# EAGLE design testboard (EAGLE 8.3.1)
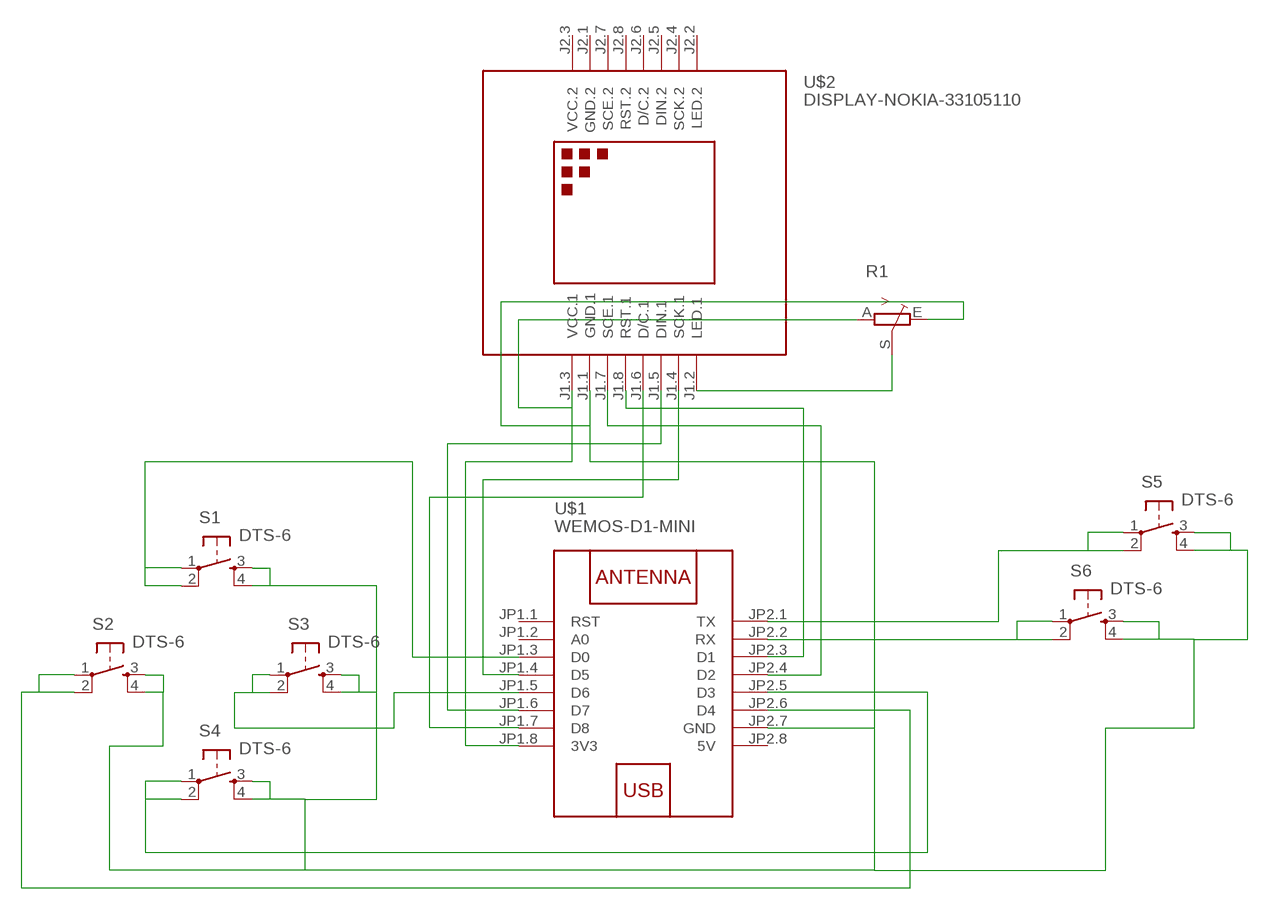
[diagram p0: schematic, sheet 1]

## Parts
R1  TRIM_EU-B25U  [B25U]
S1  DTS-6  [DTS-6]
S2  DTS-6  [DTS-6]
S3  DTS-6  [DTS-6]
S4  DTS-6  [DTS-6]
S5  DTS-6  [DTS-6]
S6  DTS-6  [DTS-6]
U$1  WEMOS-D1-MINI  [WEMOS-D1-MINI]
U$2  DISPLAY-NOKIA-33105110  [DISPLAY-NOKIA-3310]

## Nets
N$1: R1.A U$1.JP1.8(3V3) U$2.J1.3(VCC.1)
N$2: R1.E S1.3 S1.4 S2.3 S2.4 S3.3 S3.4 S4.3 S4.4 S5.3 S5.4 S6.3 S6.4 U$1.JP2.7(GND) U$2.J1.1(GND.1)
N$3: S1.1 S1.2 U$1.JP1.3(D0)
N$4: U$1.JP1.4(D5) U$2.J1.4(SCK.1)
N$5: U$1.JP2.3(D1) U$2.J1.8(RST.1)
N$6: U$1.JP1.6(D7) U$2.J1.5(DIN.1)
N$7: U$1.JP2.4(D2) U$2.J1.7(SCE.1)
N$8: R1.S U$2.J1.2(LED.1)
N$9: S3.1 S3.2 U$1.JP1.5(D6)
N$10: S2.1 S2.2 U$1.JP2.6(D4)
N$11: S4.1 S4.2 U$1.JP2.5(D3)
N$12: S6.1 S6.2 U$1.JP2.2(RX)
N$13: S5.1 S5.2 U$1.JP2.1(TX)
N$14: U$1.JP1.7(D8) U$2.J1.6(D/C.1)
Unconnected: U$1.JP1.1(RST) U$1.JP1.2(A0) U$2.J2.2(LED.2) U$2.J2.4(SCK.2) U$2.J2.5(DIN.2) U$2.J2.6(D/C.2) U$2.J2.7(SCE.2) U$2.J2.8(RST.2)

## Power pins joined to a net without a drawn wire
5V: U$1.JP2.8(5V)
GND.2: U$2.J2.1(GND.2)
VCC.2: U$2.J2.3(VCC.2)

## Library data of the parts
R1 = pot:TRIM_EU-: POTENTIOMETER
S1-S6 = switch-tact:DTS-6
U$1 = diy-modules:WEMOS-D1-MINI: WEMOS D1 mini: Mini Wi-Fi Board based on ESP-8266 device More details can be found here: https://www.wemos.cc/product/d1-mini.html Click here to find device on ebay.com <http://www.ebay.com/sch/wemos+d1+mini+nodemcu>
U$2 = diy-modules:DISPLAY-NOKIA-3310: 84x48 Dot Matrix LCD Module based on Nokia 3310 display More details available here: https://arduinoandsoftware.wordpress.com/2012/12/30/nokia-33105110-3-3v-display-with-5v-arduino/

## Board
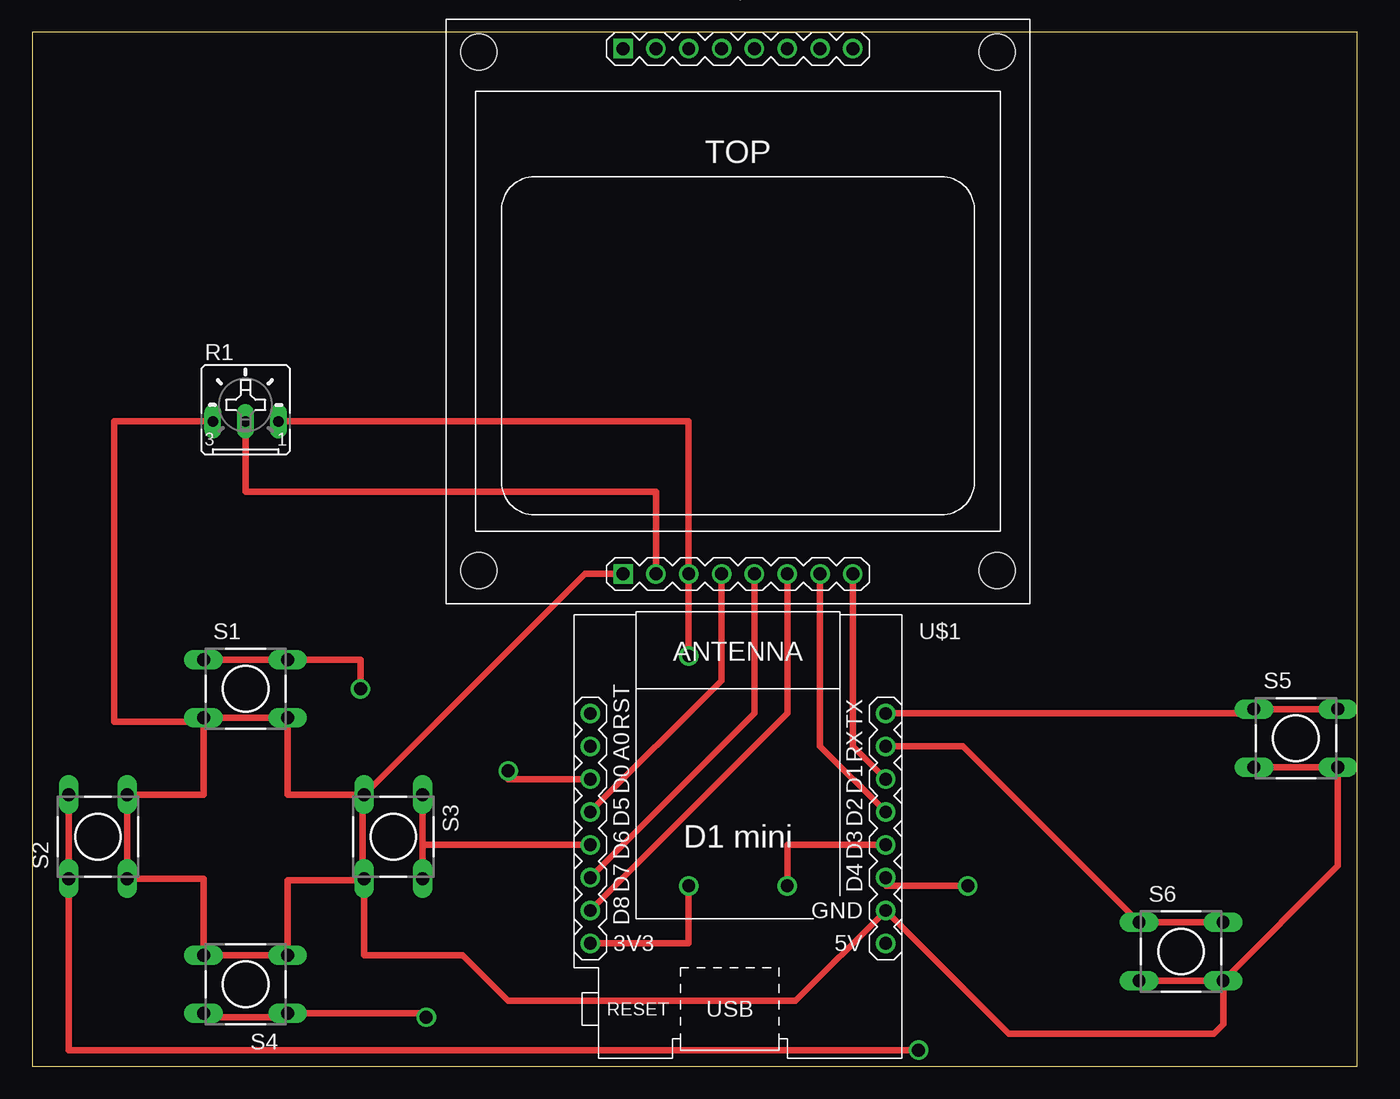
[diagram p1: board, top side]
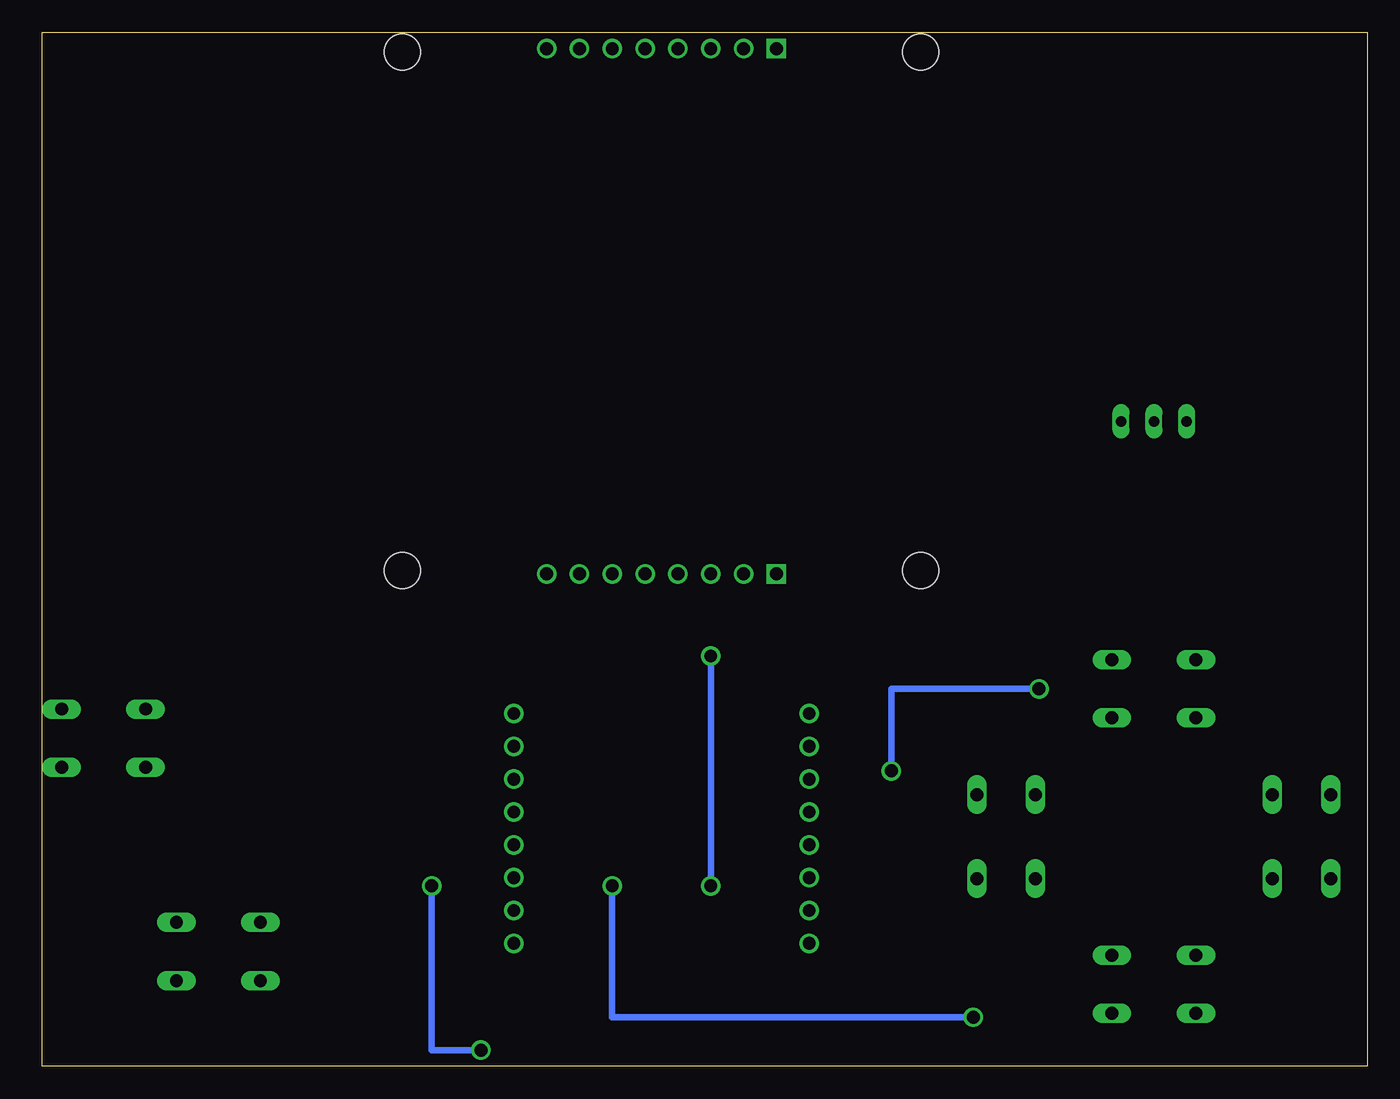
[diagram p2: board, bottom side, seen from below]

Size 102.54 x 80 mm. Coordinates in mm from the lower left corner, seen from the top.
Outline: 0,0 102.54,0 102.54,80 0,80 0,0
Copper layers (1*16): Top 0.035mm / dielectric 1.5mm / Bottom 0.035mm
Design rules "0,5mm": minimum track width 0.5mm, minimum drill 0.5mm, track to track 0.5mm, track to pad 0.5mm, pad to pad 0.5mm, via to via 0.5mm, smd to smd 6mil, copper to edge 0.5mm, drill to drill 0.5mm, minimum pad ring 10mil, minimum via ring 8mil, stop-mask expansion 4mil, vias tented up to drill 0mil, thermal gap 10mil

### Footprints (pad centres in the part's own frame; a part is rotated, then mirrored left to right if it is on the bottom)
B25U = drill 0.813 long: A 2.54,-0.889; E -2.54,-0.889; S 0,-0.889
DTS-6 = drill 1 long: 1 -3.25,2.25; 2 3.25,2.25; 3 -3.25,-2.25; 4 3.25,-2.25
WEMOS-D1-MINI = drill 1: JP1.1 -11.43,9.525; JP1.2 -11.43,6.985; JP1.3 -11.43,4.445; JP1.4 -11.43,1.905; JP1.5 -11.43,-0.635; JP1.6 -11.43,-3.175; JP1.7 -11.43,-5.715; JP1.8 -11.43,-8.255; JP2.1 11.43,9.525; JP2.2 11.43,6.985; JP2.3 11.43,4.445; JP2.4 11.43,1.905; JP2.5 11.43,-0.635; JP2.6 11.43,-3.175; JP2.7 11.43,-5.715; JP2.8 11.43,-8.255
DISPLAY-NOKIA-3310 = drill 1 square: J1.1 -8.89,-20.32; J2.1 -8.89,20.32 | drill 1: J1.2 -6.35,-20.32; J1.3 -3.81,-20.32; J1.4 -1.27,-20.32; J1.5 1.27,-20.32; J1.6 3.81,-20.32; J1.7 6.35,-20.32; J1.8 8.89,-20.32; J2.2 -6.35,20.32; J2.3 -3.81,20.32; J2.4 -1.27,20.32; J2.5 1.27,20.32; J2.6 3.81,20.32; J2.7 6.35,20.32; J2.8 8.89,20.32 | hole 2.8: -20.066,-20.066; 20.066,-20.066; 20.066,20.066; -20.066,20.066

### Placement (x,y rotation side)
R1  16.51,50.8 0 top
S1  16.51,29.21 0 top
S2  5.08,17.78 90 top
S3  27.94,17.78 270 top
S4  16.51,6.35 180 top
S5  97.79,25.4 0 top
S6  88.9,8.89 0 top
U$1  54.61,17.78 0 top
U$2  54.61,58.42 0 top

### Tracks (layer width: path | path; a pad name or v marks a point on that pad's centre or on a via)
N$1  (via drill 1)
  Top 0.5: U$1.JP1.8 50.8,9.53 v50.8,13.97 | 50.8,37.95 U$2.J1.3 | 50.8,37.95 v50.8,31.75 | R1.A 50.8,49.91 50.8,37.95
  Bottom 0.5: v50.8,31.75 v50.8,13.97
N$2
  Top 0.5: S6.4 92.15,3.25 91.44,2.54 75.57,2.54 U$1.JP2.7 59.05,5.08 36.83,5.08 33.31,8.6 25.69,8.6 S3.4 25.56,14.4 | S6.4 101.04,15.53 S5.4 S5.3 | S6.3 S6.4 | S3.3 25.56,20.9 25.56,14.4 | S3.3 19.76,21.03 S1.4 S1.3 13.26,26.85 | 13.26,26.85 13.26,21.03 S2.4 S2.3 13.26,14.53 S4.4 S4.3 19.76,14.4 25.56,14.4 | S3.3 42.76,38.1 U$2.J1.1 | R1.E 6.35,49.91 6.35,26.67 13.26,26.67 13.26,26.85
N$3  (via drill 1)
  Top 0.5: 19.05,31.75 S1.2 | 13.97,31.75 S1.1 S1.2 | S1.2 25.4,31.46 v25.4,29.21 | U$1.JP1.3 36.83,22.23 v36.83,22.86
  Bottom 0.5: v25.4,29.21 36.83,29.21 v36.83,22.86
N$4
  Top 0.5: U$2.J1.4 53.34,29.84 U$1.JP1.4
N$5
  Top 0.5: U$2.J1.8 63.5,24.77 U$1.JP2.3
N$6
  Top 0.5: U$2.J1.5 55.88,27.3 U$1.JP1.6
N$7
  Top 0.5: U$2.J1.7 60.96,24.77 U$1.JP2.4
N$8
  Top 0.5: R1.S 16.51,44.45 48.26,44.45 U$2.J1.2
N$9
  Top 0.5: S3.1 S3.2 30.19,17.14 U$1.JP1.5
N$10  (via drill 1)
  Top 0.5: S2.2 S2.1 2.83,1.27 v68.58,1.27 | U$1.JP2.6 66.04,13.97 v72.39,13.97
  Bottom 0.5: v72.39,13.97 72.39,1.27 v68.58,1.27
N$11  (via drill 1)
  Top 0.5: S4.1 19.05,3.81 13.97,3.81 S4.2 | 20.32,3.81 S4.1 | S4.1 30.48,4.1 v30.48,3.81 | U$1.JP2.5 58.42,17.14 v58.42,13.97
  Bottom 0.5: v30.48,3.81 58.42,3.81 v58.42,13.97
N$12
  Top 0.5: S6.2 S6.1 72.03,24.77 U$1.JP2.2
N$13
  Top 0.5: S5.2 S5.1 94.2,27.3 U$1.JP2.1
N$14
  Top 0.5: U$2.J1.6 58.42,27.3 U$1.JP1.7